# Altium schematic sheet AndGate.SchDoc
size A4; DocumentNumber: 13; SheetNumber: 11; SheetTotal: 15
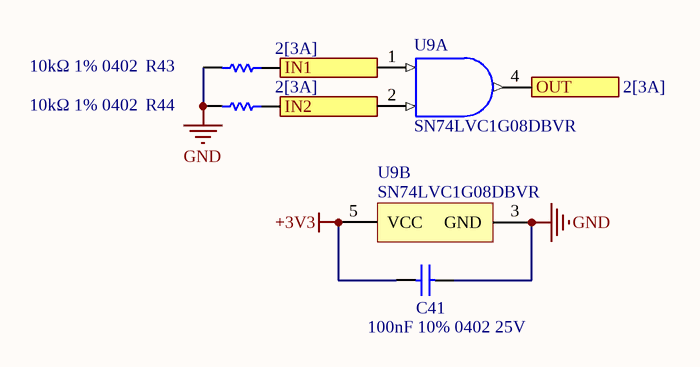
[diagram p0: AndGate.SchDoc]

## Parts
C41  100nF 10% 0402 25V  [0402N]
R43  10kΩ 1% 0402  [0402N]
R44  10kΩ 1% 0402  [0402N]
U9  SN74LVC1G08DBVR  [DBV0005A_M]  (parts A,B of 2)

## Ports
IN1 (in, see 2[3A]), IN2 (in, see 2[3A]), OUT (out, see 2[3A])

## Nets
+3V3: C41.1 U9.5(VCC)
GND: C41.2 R43.2 R44.2 U9.3(GND)
IN1: R43.1 U9.1(A) ; port IN1
IN2: R44.1 U9.2(B) ; port IN2
OUT: U9.4(Y) ; port OUT

## Library data of the parts
C41 = C0402: Capacitance: 100n; Tolerance: 10; Voltage: 25; Footprint: 0402
R43 R44 = R0402: Resistance: 10k; Tolerance: 1; Footprint: 0402
U9 = CMP-0859-00053-3: Single 2-Input Positive-AND Gate, DBV0005A, LARGE T&R; Manufacturer: Texas Instruments; Logic: True; ICC @ Nom Voltage(Max)(mA): 0.01; VCC(Min)(V): 1.65; Bits(#): 1; Rating: Catalog; Schmitt Trigger: No; Voltage(Nom)(V): 1.8,2.5,3.3,5; Output Drive (IOL/IOH)(Max)(mA): 32/-32; Gate Type: AND; tpd @ Nom Voltage(Max)(ns): 4.5,6,4,5; VCC(Max)(V): 5.5; Output Type: CMOS; F @ Nom Voltage(Max)(Mhz): 150; Input Type: CMOS/TTL; Technology Family: LVC; Sub-Family: AND Gate; PackageReference: DBV0005A; Generic Part Number: SN74LVC1G08; Operating Temperature Range(C): -40 to 125,-40 to 85; 3-State Output: No; DatasheetVersion: SCES217Y